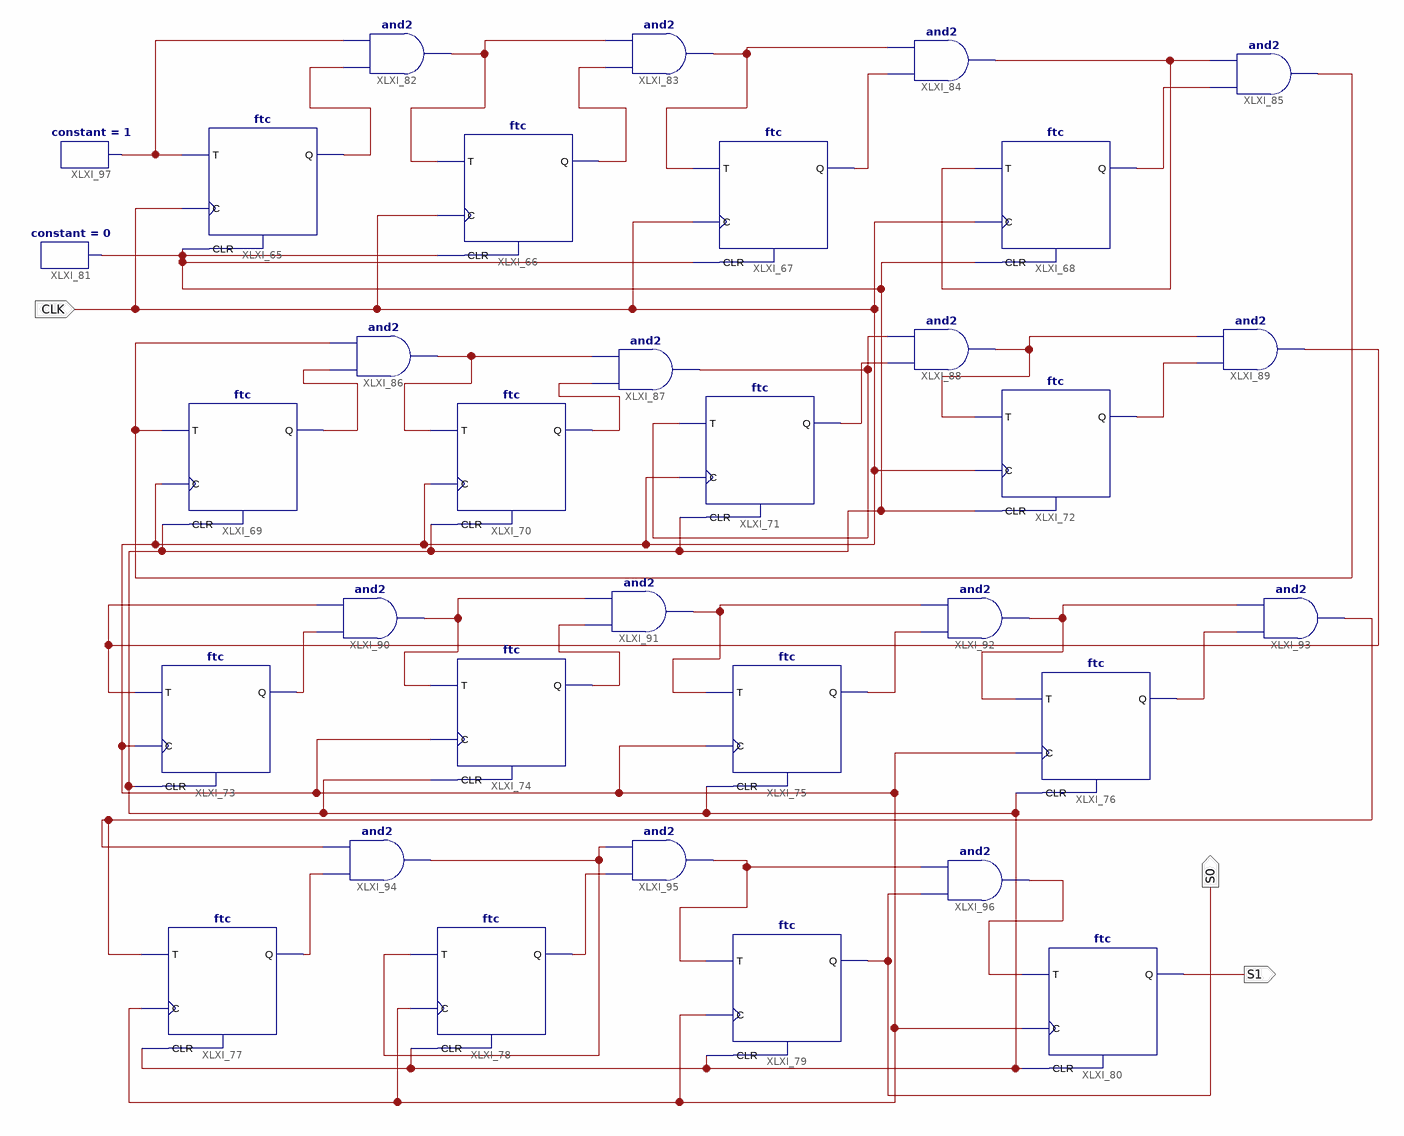
[diagram p0: schematic sheet 1]
// Xilinx ISE schematic timingcircuit.sch (spartan6) as structural Verilog: 33 symbols, 3 ports
module timingcircuit (
  input  CLK,
  output S0,
  output S1
);

  wire XLXN_100, XLXN_115, XLXN_116, XLXN_117, XLXN_118, XLXN_120, XLXN_121, XLXN_122, XLXN_123, XLXN_126,
       XLXN_127, XLXN_128, XLXN_129, XLXN_131, XLXN_132, XLXN_134, XLXN_135, XLXN_137, XLXN_138, XLXN_140,
       XLXN_141, XLXN_144, XLXN_145, XLXN_147, XLXN_148, XLXN_149, XLXN_150, XLXN_152, XLXN_153, XLXN_154,
       XLXN_156;

  ftc XLXI_65 (.C(CLK), .CLR(XLXN_100), .T(XLXN_116), .Q(XLXN_115));
  ftc XLXI_66 (.C(CLK), .CLR(XLXN_100), .T(XLXN_117), .Q(XLXN_118));
  ftc XLXI_67 (.C(CLK), .CLR(XLXN_100), .T(XLXN_121), .Q(XLXN_120));
  ftc XLXI_68 (.C(CLK), .CLR(XLXN_100), .T(XLXN_122), .Q(XLXN_123));
  ftc XLXI_69 (.C(CLK), .CLR(XLXN_100), .T(XLXN_126), .Q(XLXN_127));
  ftc XLXI_70 (.C(CLK), .CLR(XLXN_100), .T(XLXN_128), .Q(XLXN_129));
  ftc XLXI_71 (.C(CLK), .CLR(XLXN_100), .T(XLXN_131), .Q(XLXN_132));
  ftc XLXI_72 (.C(CLK), .CLR(XLXN_100), .T(XLXN_135), .Q(XLXN_134));
  ftc XLXI_73 (.C(CLK), .CLR(XLXN_100), .T(XLXN_137), .Q(XLXN_138));
  ftc XLXI_74 (.C(CLK), .CLR(XLXN_100), .T(XLXN_140), .Q(XLXN_141));
  ftc XLXI_75 (.C(CLK), .CLR(XLXN_100), .T(XLXN_144), .Q(XLXN_145));
  ftc XLXI_76 (.C(CLK), .CLR(XLXN_100), .T(XLXN_147), .Q(XLXN_148));
  ftc XLXI_77 (.C(CLK), .CLR(XLXN_100), .T(XLXN_149), .Q(XLXN_150));
  ftc XLXI_78 (.C(CLK), .CLR(XLXN_100), .T(XLXN_152), .Q(XLXN_153));
  ftc XLXI_79 (.C(CLK), .CLR(XLXN_100), .T(XLXN_154), .Q(S0));
  ftc XLXI_80 (.C(CLK), .CLR(XLXN_100), .T(XLXN_156), .Q(S1));
  constant #(.CValue("0")) XLXI_81 (.O(XLXN_100));
  and XLXI_82 (XLXN_117, XLXN_115, XLXN_116);
  and XLXI_83 (XLXN_121, XLXN_118, XLXN_117);
  and XLXI_84 (XLXN_122, XLXN_120, XLXN_121);
  and XLXI_85 (XLXN_126, XLXN_123, XLXN_122);
  and XLXI_86 (XLXN_128, XLXN_127, XLXN_126);
  and XLXI_87 (XLXN_131, XLXN_129, XLXN_128);
  and XLXI_88 (XLXN_135, XLXN_132, XLXN_131);
  and XLXI_89 (XLXN_137, XLXN_134, XLXN_135);
  and XLXI_90 (XLXN_140, XLXN_138, XLXN_137);
  and XLXI_91 (XLXN_144, XLXN_141, XLXN_140);
  and XLXI_92 (XLXN_147, XLXN_145, XLXN_144);
  and XLXI_93 (XLXN_149, XLXN_148, XLXN_147);
  and XLXI_94 (XLXN_152, XLXN_150, XLXN_149);
  and XLXI_95 (XLXN_154, XLXN_153, XLXN_152);
  and XLXI_96 (XLXN_156, S0, XLXN_154);
  constant #(.CValue("1")) XLXI_97 (.O(XLXN_116));
endmodule
